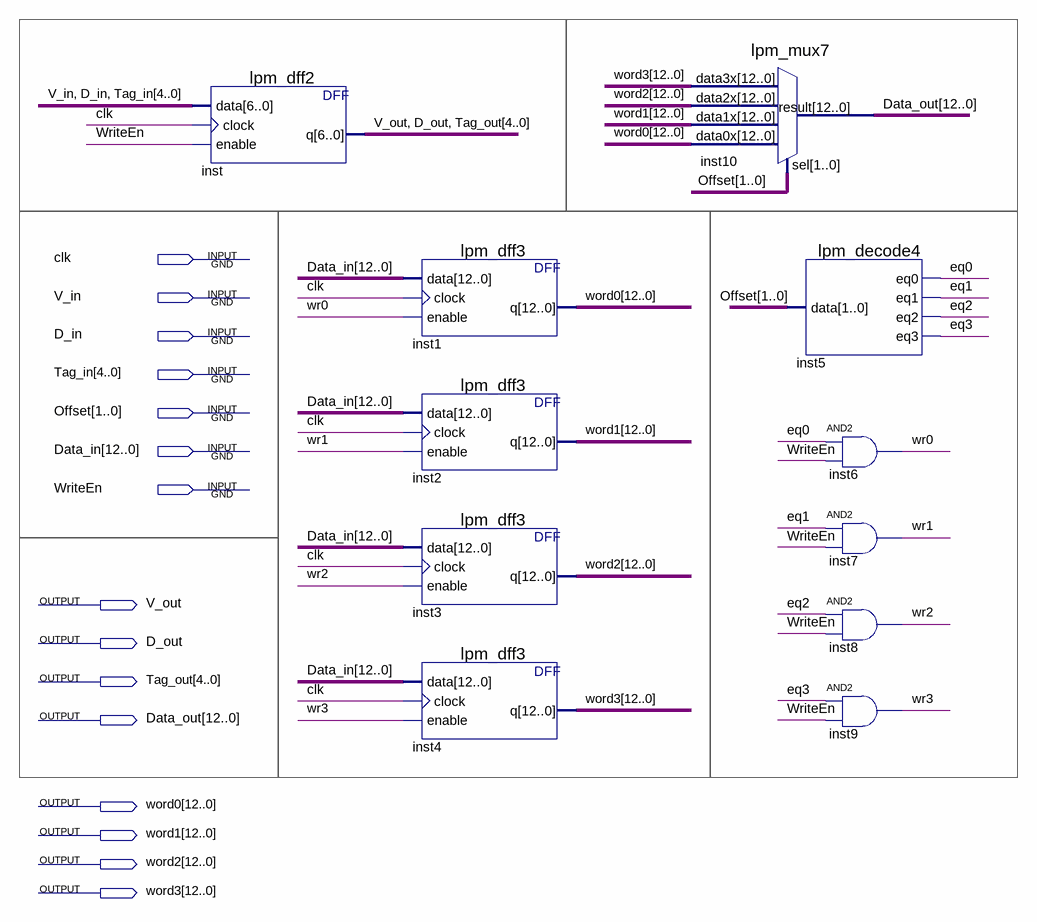
[diagram p0: schematic sheet]
// Quartus schematic cash_line.bdf as structural Verilog: 11 symbols, 15 pins
module cash_line (
  input  clk,
  input  V_in,
  input  D_in,
  input  [4:0] Tag_in,
  input  [1:0] Offset,
  input  [12:0] Data_in,
  input  WriteEn,
  output V_out,
  output D_out,
  output [4:0] Tag_out,
  output [12:0] Data_out,
  output [12:0] word0,
  output [12:0] word1,
  output [12:0] word2,
  output [12:0] word3
);

  wire eq0, eq1, eq2, eq3, wr0, wr1, wr2, wr3;

  lpm_dff2 inst (.data({V_in, D_in, Tag_in}), .clock(clk), .enable(WriteEn), .q({V_out, D_out, Tag_out}));
  lpm_dff3 inst1 (.data(Data_in), .clock(clk), .enable(wr0), .q(word0));
  lpm_dff3 inst2 (.data(Data_in), .clock(clk), .enable(wr1), .q(word1));
  lpm_dff3 inst3 (.data(Data_in), .clock(clk), .enable(wr2), .q(word2));
  lpm_dff3 inst4 (.data(Data_in), .clock(clk), .enable(wr3), .q(word3));
  lpm_mux7 inst10 (.data3x(word3), .data2x(word2), .data1x(word1), .data0x(word0), .sel(Offset), .result(Data_out));
  lpm_decode4 inst5 (.data(Offset), .eq0(eq0), .eq1(eq1), .eq2(eq2), .eq3(eq3));
  and inst6 (wr0, eq0, WriteEn);
  and inst7 (wr1, eq1, WriteEn);
  and inst8 (wr2, eq2, WriteEn);
  and inst9 (wr3, eq3, WriteEn);
endmodule
